# Altium schematic sheet Overview.SchDoc
size A; SheetNumber: 1; SheetTotal: 5
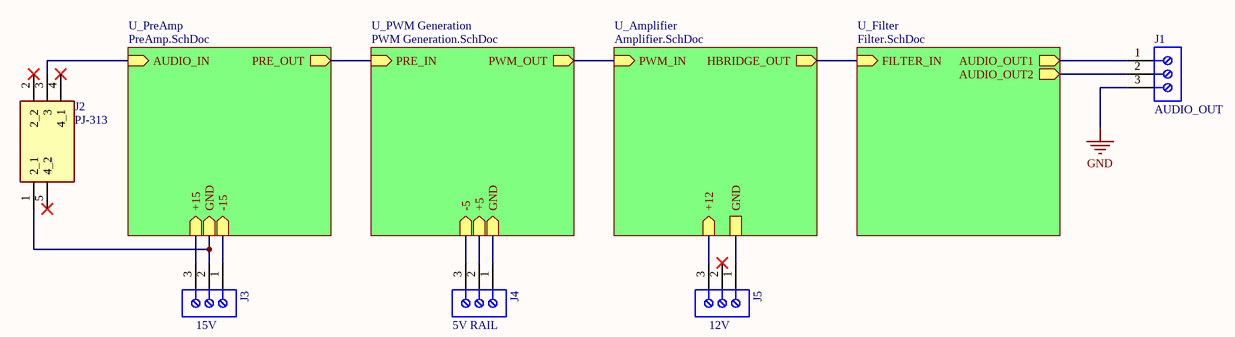
[diagram p0: Overview.SchDoc]

## Parts
J1  AUDIO_OUT  [691137810003]
J2  PJ-313  [PJ313]
J3  15V  [691137810003]
J4  5V RAIL  [691137810003]
J5  12V  [691137810003]

## Sub-sheets
U_Amplifier = Amplifier.SchDoc: PWM_IN (in), HBRIDGE_OUT (out), +12 (in), GND
U_Filter = Filter.SchDoc: FILTER_IN (in), AUDIO_OUT1 (out), AUDIO_OUT2 (out)
U_PreAmp = PreAmp.SchDoc: AUDIO_IN (in), PRE_OUT (out), +15 (in), GND (in), -15 (in)
U_PWM Generation = PWM Generation.SchDoc: PRE_IN (in), PWM_OUT (out), -5 (in), +5 (in), GND (in)

## Nets
GND: J1.3
NetJ1_1: J1.1 ; sheet U_Filter/AUDIO_OUT1
NetJ1_2: J1.2 ; sheet U_Filter/AUDIO_OUT2
NetJ2_1: J2.1(2_1) J3.2 ; sheet U_PreAmp/GND
NetJ2_3: J2.3 ; sheet U_PreAmp/AUDIO_IN
NetJ3_1: J3.1 ; sheet U_PreAmp/-15
NetJ3_3: J3.3 ; sheet U_PreAmp/+15
NetJ4_1: J4.1 ; sheet U_PWM Generation/GND
NetJ4_2: J4.2 ; sheet U_PWM Generation/+5
NetJ4_3: J4.3 ; sheet U_PWM Generation/-5
NetJ5_1: J5.1 ; sheet U_Amplifier/GND
NetJ5_3: J5.3 ; sheet U_Amplifier/+12
(unnamed): sheet U_PreAmp/PRE_OUT, sheet U_PWM Generation/PRE_IN
(unnamed): sheet U_Filter/FILTER_IN, sheet U_Amplifier/HBRIDGE_OUT
(unnamed): sheet U_PWM Generation/PWM_OUT, sheet U_Amplifier/PWM_IN

Not connected (* = marked no-connect by the designer): J2 2(2_2)* 4(4_1)* 5(4_2)*; J5 2*

## Library data of the parts
J1 J3-J5 = CMP-1502-03382-3: 10.00 mm Terminal Block, Horizontal Entr / 691137810003
J2 = PJ-313: Connector; Manufacturer_Name: Haoyu; Datasheet Link: http://p.globalsources.com/IMAGES/PDT/SPEC/678/K1007224678.pdf; Height: 5mm; Manufacturer_Part_Number: PJ-313